# Altium schematic sheet module 5_IR TRANSMITTER.SchDoc
size 242 x 148 mm
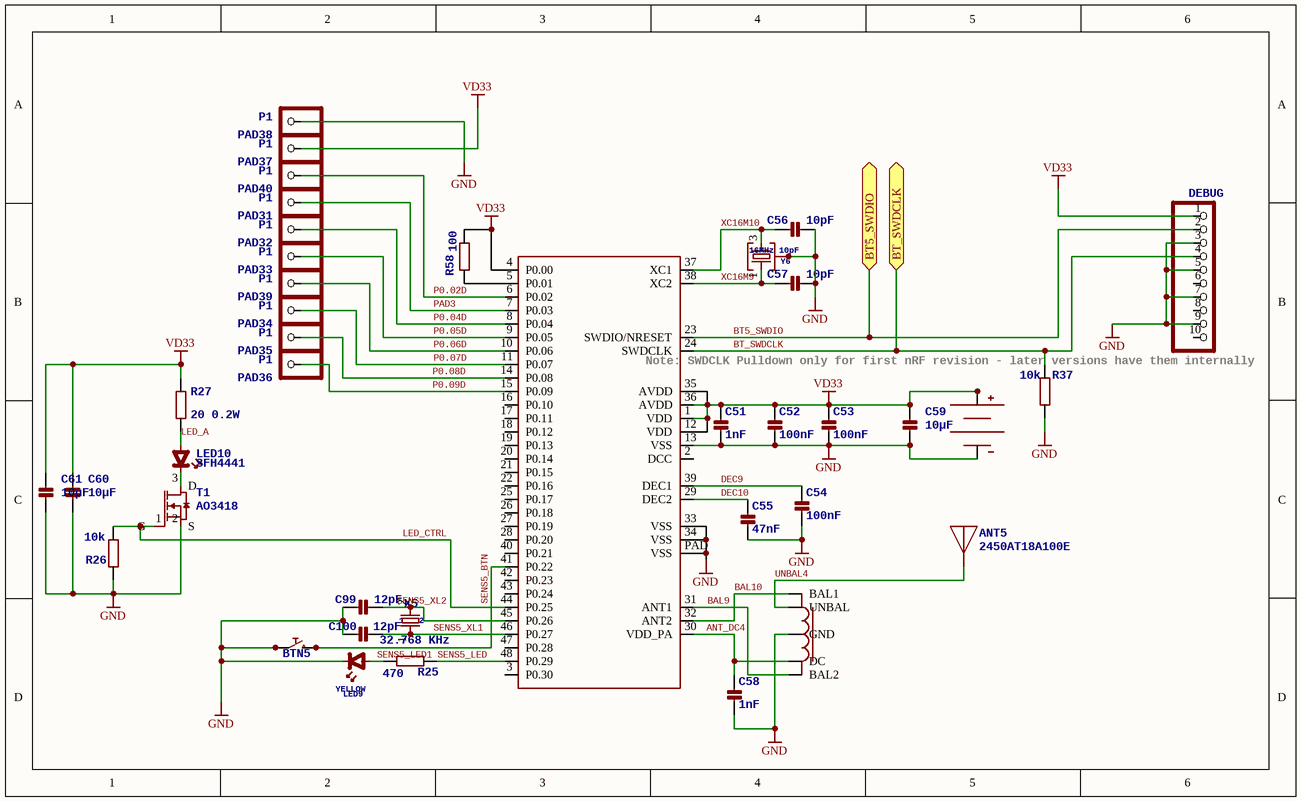
[diagram p0: module 5_IR TRANSMITTER.SchDoc]

## Parts
ANT5  2450AT18A100E  [1206_MINIMELF_COMBO]
BALUN5  2450BM14A0002T  [6-PIN-0603]  (value not drawn)
BAT5  BATTERYBK-912  [BK-912]  (value not drawn)
BT5  NRF51822QFN48  [QFN48_EP]  (value not drawn)
BTN5  Tact Sw 4.6x2.8  [CK-KMR2]  (value not drawn)
C51  1nF  [0402]
C52  100nF  [0402]
C53  100nF  [0402]
C54  100nF  [0402]
C55  47nF  [0402]
C56  10pF  [0402]
C57  10pF  [0402]
C58  1nF  [0402]
C59  10µF  [0603]
C60  10µF  [0603]
C61  10µF  [0603]
C99  12pF  [0402]
C100  12pF  [0402]
DEBUG5  DEBUG  [2X05_SMT]  (no BOM)
LED9  YELLOW  [0402_POLAR]
LED10  SFH4441  [MIDLED]
PAD31  P1  [PCB_MEDIUM_RECT_PAD]  (no BOM)
PAD32  P1  [PCB_MEDIUM_RECT_PAD]  (no BOM)
PAD33  P1  [PCB_MEDIUM_RECT_PAD]  (no BOM)
PAD34  P1  [PCB_MEDIUM_RECT_PAD]  (no BOM)
PAD35  P1  [PCB_MEDIUM_RECT_PAD]  (no BOM)
PAD36  P1  [PCB_MEDIUM_RECT_PAD]  (no BOM)
PAD37  P1  [PCB_MEDIUM_RECT_PAD]  (no BOM)
PAD38  P1  [PCB_MEDIUM_RECT_PAD]  (no BOM)
PAD39  P1  [PCB_MEDIUM_RECT_PAD]  (no BOM)
PAD40  P1  [PCB_MEDIUM_RECT_PAD]  (no BOM)
R25  470  [0402]
R26  10k  [0402]
R27  20 0.2W  [1206_MINIMELF_COMBO]
R37  10k  [0402]
R58  100  [0402]
T1  AO3418  [SOT23]
X5  32.768 KHz  [1206_MINIMELF_COMBO]
Y6  16MHz 10pF  [CRYSTAL25X20]

## Ports
BT5_SWDIO, BT_SWDCLK

## Nets
GND: BALUN5.2(GND) BAT5.- BT5.13(VSS) BT5.33(VSS) BT5.34(VSS) BT5.PAD(VSS) BTN5.P1 BTN5.P2 C51.2 C52.2 C53.2 C54.2 C55.2 C56.2 C57.2 C58.2 C59.2(P2) C60.2(P2) C61.2(P2) C99.1 C100.1 DEBUG5.3 DEBUG5.5 DEBUG5.7 DEBUG5.9 LED9.K(CATHODE) PAD38.1 R26.1 R37.1 T1.2(S) Y6.2 Y6.4
VD33: BAT5.+1(+) BAT5.+2(+) BT5.1(VDD) BT5.4(P0.00) BT5.12(VDD) BT5.35(AVDD) BT5.36(AVDD) C51.1 C52.1 C53.1 C59.1(P1) C60.1(P1) C61.1(P1) DEBUG5.1 PAD37.1 R27.2 R58.1
ANT_DC4: BALUN5.5(DC) BT5.30(VDD_PA) C58.1
BAL9: BALUN5.4(BAL2) BT5.31(ANT1)
BAL10: BALUN5.3(BAL1) BT5.32(ANT2)
BT5_SWDIO: BT5.23(SWDIO/NRESET) DEBUG5.2 ; port BT5_SWDIO
BT_SWDCLK: BT5.24(SWDCLK) DEBUG5.4 R37.2 ; port BT_SWDCLK
DEC9: BT5.39(DEC1) C54.1
DEC10: BT5.29(DEC2) C55.1
LED_A: LED10.A(ANODE) R27.1
LED_CTRL: BT5.44(P0.25) R26.2 T1.1(G)
P0.02D: BT5.6(P0.02) PAD40.1
P0.04D: BT5.8(P0.04) PAD32.1
P0.05D: BT5.9(P0.05) PAD33.1
P0.06D: BT5.10(P0.06) PAD39.1
P0.07D: BT5.11(P0.07) PAD34.1
P0.08D: BT5.14(P0.08) PAD35.1
P0.09D: BT5.15(P0.09) PAD36.1
PAD3: BT5.7(P0.03) PAD31.1
SENS5_BTN: BT5.41(P0.22) BTN5.P3 BTN5.P4
SENS5_LED: BT5.48(P0.29) R25.1
SENS5_LED1: LED9.A(ANODE) R25.2
SENS5_XL1: BT5.46(P0.27) C100.2 X5.1
SENS5_XL2: BT5.45(P0.26) C99.2 X5.2
UNBAL4: ANT5.1(ANT) BALUN5.1(UNBAL)
XC16M9: BT5.38(XC2) C57.1 Y6.1
XC16M10: BT5.37(XC1) C56.1 Y6.3
NetBT5_5: BT5.5(P0.01) R58.2
NetLED10_C: LED10.C(CATHODE) T1.3(D)

Not connected (* = marked no-connect by the designer): BT5 2(DCC) 3(P0.30) 16(P0.10) 17(P0.11) 18(P0.12) 19(P0.13) 20(P0.14) 21(P0.15) 22(P0.16) 25(P0.17) 26(P0.18) 27(P0.19) 28(P0.20) 40(P0.21) 42(P0.23) 43(P0.24) 47(P0.28); DEBUG5 6 8 10

## Notes on the sheet
- (near BT5) Note: SWDCLK Pulldown only for first nRF revision - later versions have them internally

## Library data of the parts
ANT5 = ANTENNA_MONOPOLE1206: 2.45 GHz Antenna; SMD: Yes
BALUN5 = BALUN: 2.45 GHz Impedance Matched Balun-Filter; SMD: Yes
BAT5 = BATTERYBK-912: Coin battery holder; SMD: Yes
BT5 = NRF51822QFN48: Nordic Bluetooth 4.0 low energy modul; SMD: Yes
BTN5 = PUSHBUTTONKMR2XX: Push button; SMD: Yes
C51-C58 C99 C100 = CAP_CERAMIC0402: Ceramic Capacitor; SMD: Yes
C59-C61 = CAP_CERAMIC0603: Ceramic Capacitor; SMD: Yes
DEBUG5 = HEADER-2X5SMD-1.27MM: cortex DEBUG connector
LED9 = LED0402: LED common; SMD: Yes
LED10 = LEDMIDLED: LED common; SMD: Yes
PAD31-PAD40 = HEADER-1X1SMD_MEDIUM: <b>PIN HEADER</b>
R25 R26 R37 R58 = R-EU_0402: RESISTOR; SMD: Yes
R27 = R-EU_1206_MINIMELF_COMBO: RESISTOR; SMD: Yes
T1 = NMOS_ENH: N-Channel MOSFET, enhancement mode; SMD: Yes
X5 = CRYSTAL1206: CL05C120JB5; 1: 1; 2: 2; SMD: Yes
Y6 = CRYSTAL_WITH_GROUND25X20: 16MHz crystal 2.5x2mm; SMD: Yes